# Altium schematic sheet Sound&Light IC evaluation board.SchDoc
size A4; SheetNumber: 1; SheetTotal: 1
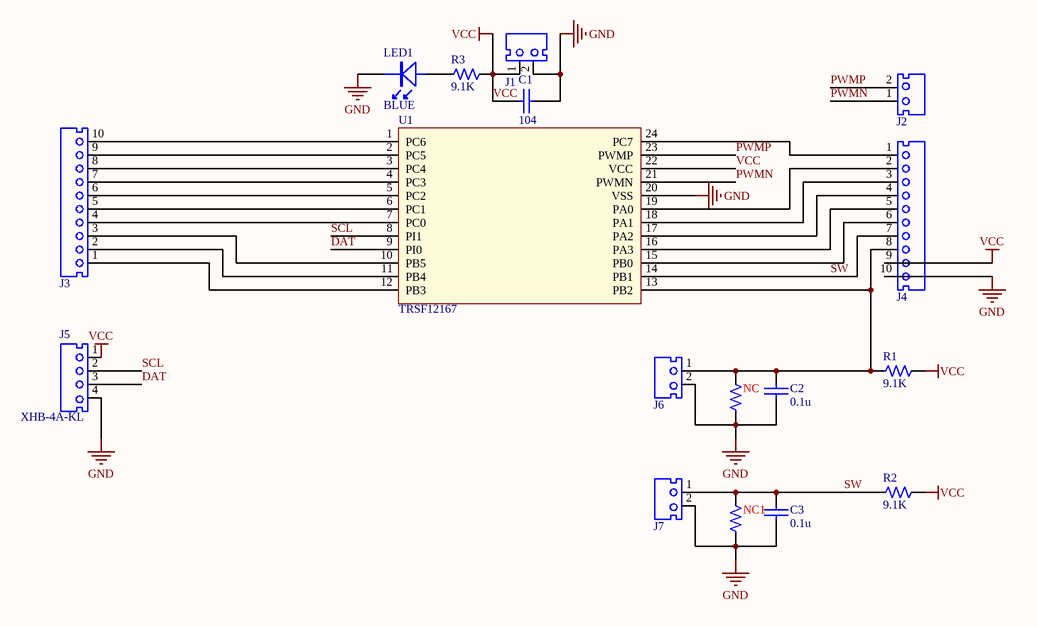
[diagram p0: Sound&Light IC evaluation board.SchDoc]

## Parts
C1  value 104  [CAPC0603-RW]  (hidden comment: T542021036508)
C2  value 0.1u  [CAPC0603-RW]  (hidden comment: T542021036508)
C3  value 0.1u  [CAPC0603-RW]  (hidden comment: T542021036508)
J1  T690300125300  [CONN 2P PH=2.5mm HAA250A-2 WHITE]  (value not drawn)
J2  T690300125300  [CONN 2P PH=2.5mm HAA250A-2 WHITE]  (value not drawn)
J3  T690300105400  [CONN 10P PH=2.5mm ST CI2210P1VK0-NH]  (value not drawn)
J4  T690300105400  [CONN 10P PH=2.5mm ST CI2210P1VK0-NH]  (value not drawn)
J5  MFG Part: XHB-4A-KL  [CONN 4P PH=2.5mm XHB-4A-KL]  (hidden comment: T690300127400)
J6  T690300125300  [CONN 2P PH=2.5mm HAA250A-2 WHITE]  (value not drawn)
J7  T690300125300  [CONN 2P PH=2.5mm HAA250A-2 WHITE]  (value not drawn)
LED1  Color: BLUE  [LED0603_BLUE]  (hidden comment: T575011480204)
NC  T502294202399  [0603-RW]  (value not drawn)
NC1  T502294202399  [0603-RW]  (value not drawn)
R1  value 9.1K  [0603-RW]  (hidden comment: T502294202399)
R2  value 9.1K  [0603-RW]  (hidden comment: T502294202399)
R3  value 9.1K  [0603-RW]  (hidden comment: T502294202399)
U1  MFG Part: TRSF12167  [SSOP24(150mil)]  (hidden comment: BS86C08C 24SSOP)

## Nets
GND: C1.1 C2.1 C3.1 J1.2 J4.10 J5.4 J6.2 J7.2 LED1.2(K) NC.1 NC1.1 U1.20(VSS)
VCC: C1.2 J1.1 J4.9 J5.1 R1.2 R2.2 R3.2 U1.22(VCC)
DAT: J5.3 U1.9(PI0)
PWMN: J2.1 U1.21(PWMN)
PWMP: J2.2 U1.23(PWMP)
SCL: J5.2 U1.8(PI1)
SW: C3.2 J4.7 J7.1 NC1.2 R2.1 U1.14(PB1)
NetC2_2: C2.2 J4.8 J6.1 NC.2 R1.1 U1.13(PB2)
NetJ3_1: J3.1 U1.12(PB3)
NetJ3_2: J3.2 U1.11(PB4)
NetJ3_3: J3.3 U1.10(PB5)
NetJ3_4: J3.4 U1.7(PC0)
NetJ3_5: J3.5 U1.6(PC1)
NetJ3_6: J3.6 U1.5(PC2)
NetJ3_7: J3.7 U1.4(PC3)
NetJ3_8: J3.8 U1.3(PC4)
NetJ3_9: J3.9 U1.2(PC5)
NetJ3_10: J3.10 U1.1(PC6)
NetJ4_1: J4.1 U1.24(PC7)
NetJ4_2: J4.2 U1.19(PA0)
NetJ4_3: J4.3 U1.18(PA1)
NetJ4_4: J4.4 U1.17(PA2)
NetJ4_5: J4.5 U1.16(PA3)
NetJ4_6: J4.6 U1.15(PB0)
NetLED1_1: LED1.1(A) R3.1

## Notes on the sheet
- Draw by
- Original

## Library data of the parts
C1-C3 = CAP0603 0.01uF 50V 5%_X7R_WALSIN: CAP X7R .01UF 50V +-5% 0603 WALSIN L; Tolerance: 5%; Type: Capacitor; CREATE_NAME: Nathan; Voltage: 16v; DIP&SMD: SMD; SAP: T542021036508; PACKAGE: CAPC0603; Vendor Name: *; MFG: WALSIN; MFG Part: *; Other: X7R; CREATE_TIME: 13-July-2016; Customer Specific: N/A
J1 J2 J6 J7 = CONN 2P PH=2.5mm HAA250A-2 BLACK: CONNECTOR HA2.5 2PIN BLACK K; Value: 2.5mm; MFG: 金瑞康; CREATE_NAME: Nathan; Current: 3A; DIP&SMD: DIP; SAP: T690300125300; MFG Part: HAA250A-2 BLACK; Vendor Name: *; Vendor Code: *; Type: Connector; CREATE_TIME: 24-Nov-2017
J3 J4 = CONN 10P PH=2.5mm ST CI2210P1VK0-NH: WTB CONN. 2.5MM 10PIN CI2210P1VK0-NH CV G; MFG: CVILUX; CREATE_NAME: Nathan; DIP&SMD: DIP; Value: 2.5mm; SAP: T690300105400; MFG Part: CI2210P1VK0-NH; Vendor Name: *; Vendor Code: *; Type: Connector; CREATE_TIME: 21-Mar-2017; Current: *
J5 = CONN 4P PH=2.5mm XHB-4A-KL: CONNECTOR 4PIN P 2.54MM 180° K; Value: 2.5mm; MFG: 金佳; CREATE_NAME: Nathan; DIP&SMD: DIP; SAP: T690300127400; Vendor Name: *; Vendor Code: *; Type: Connector; CREATE_TIME: 14-DEC-2017; Current: *
LED1 = LED0603B_LTST-C193TBKT-5A: LED 465 0603 LTST-C193TBK LITEON ( L; MFG: LITEON (光寶); CREATE_NAME: Nathan; Lens Type: WALTER CLEAR; DIP&SMD: SMD; MFG Part: LTST-C193TBKT-5A; SAP: T575011480204; Package: 0603; Vendor Code: *; Vendor Name: *; Type: LED; CREATE_TIME: 28-Feb-2019
NC NC1 = RES0603 1/10W +-0.1% 29.4K OHM 100PPM: CHIP 29.4K OHM 100PPM +-1% 0603 WALS L; MFG Part: WR06X2942FTL; Power: 1/10W; MFG: WALSIN; CREATE_NAME: Tom; TOL: +-0.1%; DIP&SMD: SMD; Value: 9.1K; Vendor Code: *; SAP: T502294202399; Vendor Name: *; Type: Resistor; CREATE_TIME: 14-Sep-2016; PACKAGE: 0603; Customer Specific: N/A
R1-R3 = RES0603 1/10W +-0.1% 29.4K OHM 100PPM: CHIP 29.4K OHM 100PPM +-1% 0603 WALS L; MFG Part: WR06X2942FTL; Power: 1/10W; MFG: WALSIN; CREATE_NAME: Tom; TOL: +-0.1%; DIP&SMD: SMD; Vendor Code: *; SAP: T502294202399; Vendor Name: *; Type: Resistor; CREATE_TIME: 14-Sep-2016; PACKAGE: 0603; Customer Specific: N/A
U1 = BS86C08C 24SSOP: BS86C08C_24SSOP; MFG: HOLTEK; CREATE_NAME: Nathan; DIP&SMD: SMD; Vendor Code: *; Vendor Name: *; SAP: *; Type: IC; CREATE_TIME: 16-Sep-2020; Customer Specific: N/A